# Altium schematic sheet KhoiPhu.SchDoc
size A; SheetNumber: 6; SheetTotal: 6
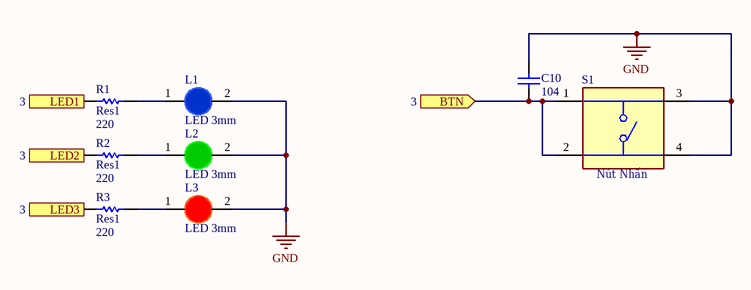
[diagram p0: KhoiPhu.SchDoc]

## Parts
C10  104  [tu gom]
L1  LED 3mm  [LED-3MM-BLUE]
L2  LED 3mm  [LED-3MM-GREEN]
L3  LED 3mm  [LED-3MM-RED]
R1  Res1  value 220  [AXIAL-0.3]
R2  Res1  value 220  [AXIAL-0.3]
R3  Res1  value 220  [AXIAL-0.3]
S1  Nút Nhấn  [SW_TS04-66-95-BK-100-SMT]

## Ports
BTN (in, see 3), LED1 (in, see 3), LED2 (in, see 3), LED3 (in, see 3)

## Nets
GND: C10.1 L1.2(K) L2.2(K) L3.2(K) S1.3 S1.4
BTN: C10.2 S1.1 S1.2 ; port BTN
LED1: R1.1 ; port LED1
LED2: R2.1 ; port LED2
LED3: R3.1 ; port LED3
NetL1_1: L1.1(A) R1.2
NetL2_1: L2.1(A) R2.2
NetL3_1: L3.1(A) R3.2

## Library data of the parts
C10 = Tu gom 104 50V: Cắm; So_Chan: 2; Ten_Linh_Kien: Tụ gốm 104 100nF 50V; Don_Vi: Con; Ma_Hang: MH004761; Chung_Loai: Cắm; Kieu_Chan: *
L1 = LED 3mm Xanh Duong: Cắm; Don_Vi: Con; Ma_Hang: MH009003; Ten_Linh_Kien: LED 3MM Xanh Dương SS (1000c); Ghi_Chu: *; Kieu_Chan: *; Chung_Loai: Cắm
L2 = LED 3mm Xanh La: Cắm; Don_Vi: Con; Ma_Hang: MH001054; Ten_Linh_Kien: Led 3MM Phủ Xanh (10c); Ghi_Chu: *; Kieu_Chan: *; Chung_Loai: Cắm
L3 = LED 3mm Do: Cắm; Don_Vi: Con; Ma_Hang: MH003892; Ten_Linh_Kien: Led 3MM Phủ Đỏ (10c); Ghi_Chu: *; Kieu_Chan: *; Chung_Loai: Cắm
R1-R3 = Res1: Resistor; Published: 8-Jun-2000; LatestRevisionDate: 17-Jul-2002; LatestRevisionNote: Re-released for DXP Platform.; PackageReference: AXIAL-0.3; Publisher: Altium Limited; PackageDescription: Axial Device, Thru-Hole; 2 Leads; 0.3 in Pin Spacing
S1 = TS04-66-95-BK-100-SMT: 6 x 6 mm, 9.5 mm Actuator Height, 100 gf, Black, Surface Mount, SPST, Tactile Switch; MF: Same Sky; SnapEDA_Link: https://www.snapeda.com/parts/TS04-66-95-BK-100-SMT/Same+Sky/view-part/?ref=snap; Package: None; Value: *; MP: TS04-66-95-BK-100-SMT; Check_prices: https://www.snapeda.com/parts/TS04-66-95-BK-100-SMT/Same+Sky/view-part/?ref=eda